# Altium schematic sheet fpga-bank0.SchDoc: FPGA - Bank 0
size Legal; CheckedBy: J. Brinton; CompanyName: Signal Laboratories, Inc.; DrawnBy: J. Brinton; Engineer: J. Brinton; Address1: 3479 Edison Way; Address2: Menlo Park CA 94025; Address3: +1 (877) 778-8435; Address4: siglabs.com; DocumentNumber: 27; Revision: 2b; SheetNumber: 28; SheetTotal: 58
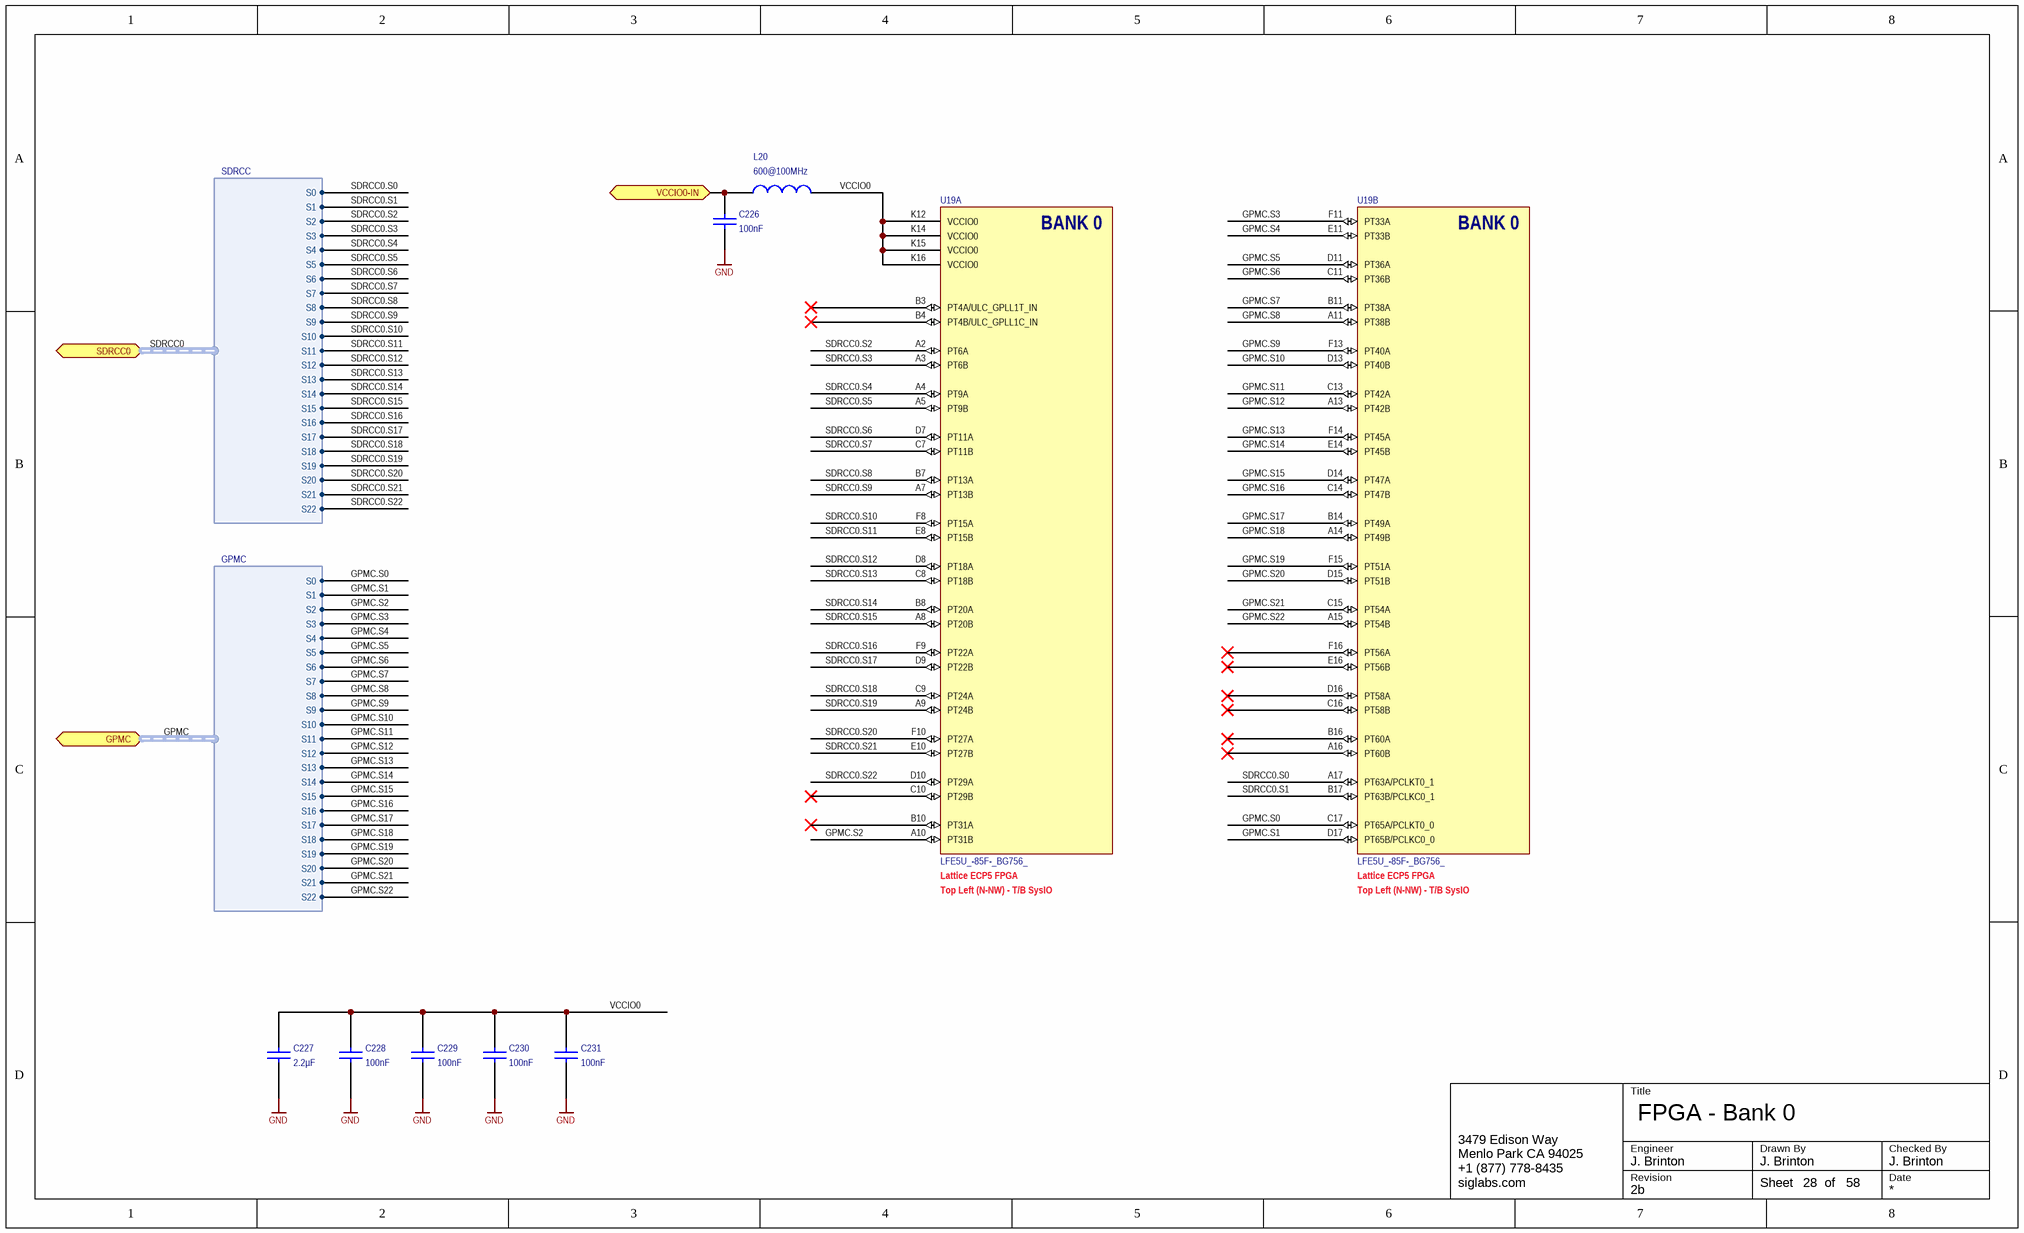
[diagram p0: fpga-bank0.SchDoc]

## Parts
C226  value 100nF  [CAPC1005X56N]  (hidden comment: GRM155R71C104KA88J)
C227  value 2.2µF  [CAPC1608X90N]  (hidden comment: GRM21BR71C225KA12L)
C228  value 100nF  [CAPC1005X56N]  (hidden comment: GRM155R71C104KA88J)
C229  value 100nF  [CAPC1005X56N]  (hidden comment: GRM155R71C104KA88J)
C230  value 100nF  [CAPC1005X56N]  (hidden comment: GRM155R71C104KA88J)
C231  value 100nF  [CAPC1005X56N]  (hidden comment: GRM155R71C104KA88J)
L20  value 600@100MHz  [0402]  (hidden comment: BLM15PX601SN1D)
U19  LFE5U_-85F-_BG756_  [caBGA756]  (parts A,B of 19)

## Ports
GPMC (harness GPMC), SDRCC0 (harness SDRCC), VCCIO0-IN

## Harnesses
GPMC: S0, S1, S2, S3, S4, S5, S6, S7, S8, S9, S10, S11, S12, S13, S14, S15, S16, S17, S18, S19, S20, S21, S22
SDRCC: S0, S1, S2, S3, S4, S5, S6, S7, S8, S9, S10, S11, S12, S13, S14, S15, S16, S17, S18, S19, S20, S21, S22

## Nets
GND: C226.1 C227.1 C228.1 C229.1 C230.1 C231.1
GPMC.S0: U19.C17(PT65A/PCLKT0_0) ; port GPMC.S0
GPMC.S1: U19.D17(PT65B/PCLKC0_0) ; port GPMC.S1
GPMC.S2: U19.A10(PT31B) ; port GPMC.S2
GPMC.S3: U19.F11(PT33A) ; port GPMC.S3
GPMC.S4: U19.E11(PT33B) ; port GPMC.S4
GPMC.S5: U19.D11(PT36A) ; port GPMC.S5
GPMC.S6: U19.C11(PT36B) ; port GPMC.S6
GPMC.S7: U19.B11(PT38A) ; port GPMC.S7
GPMC.S8: U19.A11(PT38B) ; port GPMC.S8
GPMC.S9: U19.F13(PT40A) ; port GPMC.S9
GPMC.S10: U19.D13(PT40B) ; port GPMC.S10
GPMC.S11: U19.C13(PT42A) ; port GPMC.S11
GPMC.S12: U19.A13(PT42B) ; port GPMC.S12
GPMC.S13: U19.F14(PT45A) ; port GPMC.S13
GPMC.S14: U19.E14(PT45B) ; port GPMC.S14
GPMC.S15: U19.D14(PT47A) ; port GPMC.S15
GPMC.S16: U19.C14(PT47B) ; port GPMC.S16
GPMC.S17: U19.B14(PT49A) ; port GPMC.S17
GPMC.S18: U19.A14(PT49B) ; port GPMC.S18
GPMC.S19: U19.F15(PT51A) ; port GPMC.S19
GPMC.S20: U19.D15(PT51B) ; port GPMC.S20
GPMC.S21: U19.C15(PT54A) ; port GPMC.S21
GPMC.S22: U19.A15(PT54B) ; port GPMC.S22
SDRCC0.S0: U19.A17(PT63A/PCLKT0_1) ; port SDRCC0.S0
SDRCC0.S1: U19.B17(PT63B/PCLKC0_1) ; port SDRCC0.S1
SDRCC0.S2: U19.A2(PT6A) ; port SDRCC0.S2
SDRCC0.S3: U19.A3(PT6B) ; port SDRCC0.S3
SDRCC0.S4: U19.A4(PT9A) ; port SDRCC0.S4
SDRCC0.S5: U19.A5(PT9B) ; port SDRCC0.S5
SDRCC0.S6: U19.D7(PT11A) ; port SDRCC0.S6
SDRCC0.S7: U19.C7(PT11B) ; port SDRCC0.S7
SDRCC0.S8: U19.B7(PT13A) ; port SDRCC0.S8
SDRCC0.S9: U19.A7(PT13B) ; port SDRCC0.S9
SDRCC0.S10: U19.F8(PT15A) ; port SDRCC0.S10
SDRCC0.S11: U19.E8(PT15B) ; port SDRCC0.S11
SDRCC0.S12: U19.D8(PT18A) ; port SDRCC0.S12
SDRCC0.S13: U19.C8(PT18B) ; port SDRCC0.S13
SDRCC0.S14: U19.B8(PT20A) ; port SDRCC0.S14
SDRCC0.S15: U19.A8(PT20B) ; port SDRCC0.S15
SDRCC0.S16: U19.F9(PT22A) ; port SDRCC0.S16
SDRCC0.S17: U19.D9(PT22B) ; port SDRCC0.S17
SDRCC0.S18: U19.C9(PT24A) ; port SDRCC0.S18
SDRCC0.S19: U19.A9(PT24B) ; port SDRCC0.S19
SDRCC0.S20: U19.F10(PT27A) ; port SDRCC0.S20
SDRCC0.S21: U19.E10(PT27B) ; port SDRCC0.S21
SDRCC0.S22: U19.D10(PT29A) ; port SDRCC0.S22
VCCIO0: C227.2 C228.2 C229.2 C230.2 C231.2 L20.1 U19.K12(VCCIO0) U19.K14(VCCIO0) U19.K15(VCCIO0) U19.K16(VCCIO0)
VCCIO0-IN: C226.2 L20.2 ; port VCCIO0-IN

Not connected (* = marked no-connect by the designer): U19 A16(PT60B)* B3(PT4A/ULC_GPLL1T_IN)* B4(PT4B/ULC_GPLL1C_IN)* B10(PT31A)* B16(PT60A)* C10(PT29B)* C16(PT58B)* D16(PT58A)* E16(PT56B)* F16(PT56A)*

## Buses and harness runs
harness GPMC = port GPMC
harness SDRCC0 = port SDRCC0

## Notes on the sheet
- (near U19) Top Left (N-NW) - T/B SysIO
- (near U19) Lattice ECP5 FPGA
- Title
- Engineer
- Revision
- Drawn By
- Checked By
- Date
- Sheet
- of
- (in symbol LFE5U_-85F-_BG756_, part A) BANK 0
- (in symbol LFE5U_-85F-_BG756_, part B) BANK 0

## Library data of the parts
C226 C228-C231 = GRM155R71A104KA01J: Ceramic Capacitor 100nF ±10% 16V X7R 0402; Manufacturer: Murata; Tr: -55:125; Manufacturer P/N: GRM155R71C104KA88J; Tolerance: ±10%; Package: 0402; Voltage: 16V
C227 = GRM188R71A225KE15D: Ceramic Capacitor 2.2uF ±10% 10V X7R 0603; Manufacturer: Murata; Tr: -55:125; Manufacturer P/N: GRM188R71A225KE15D; Tolerance: ±10%; Package: 0603; Voltage: 10V
L20 = IND 0402: Ferrite Bead 600-Ohm @ 100MHz 900mA 0402; Manufacturer: Murata; Tolerance: ±25%; Tr: -55:125; Manufacturer P/N: BLM15PX601SN1D; Package: 0402
U19 = LFE5U_-85F-_BG756_: ECP5 FPGA, 85k LUT, 756-caBGA; Manufacturer: Lattice Semiconductor; Manufacturer P/N: LFE5U_-85F-_BG756_